# EAGLE design 4_Button_Array_LED (EAGLE 9.5.2)
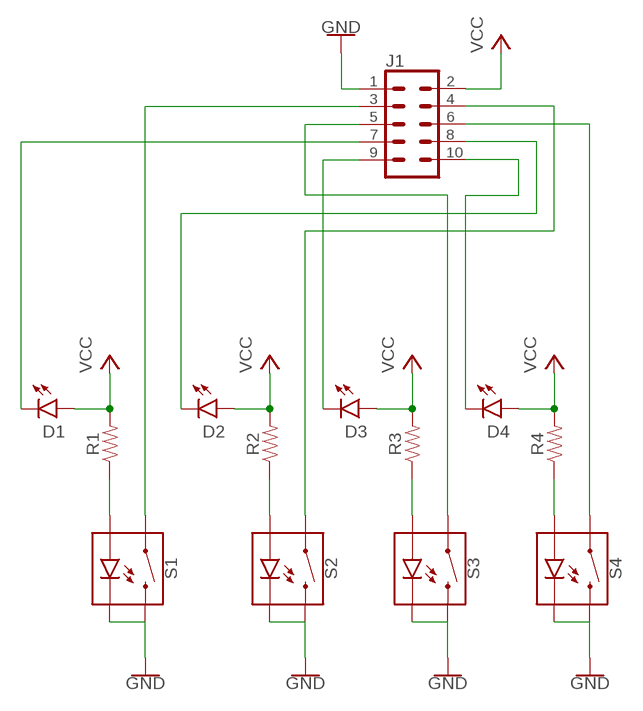
[diagram p0: schematic, sheet 1]

## Parts
D1  LED3MM  [LED_3MM]
D2  LED3MM  [LED_3MM]
D3  LED3MM  [LED_3MM]
D4  LED3MM  [LED_3MM]
J1  CONN_05X2SHD-NS  [2X5-SHROUDED-NS]
R1  RESISTOR1206  [1206]
R2  RESISTOR1206  [1206]
R3  RESISTOR1206  [1206]
R4  RESISTOR1206  [1206]
S1  MOMENTARY-SWITCH-SPST-LED-PTH-12MM  [TACTILE_SWITCH_LED_PTH_12MM]
S2  MOMENTARY-SWITCH-SPST-LED-PTH-12MM  [TACTILE_SWITCH_LED_PTH_12MM]
S3  MOMENTARY-SWITCH-SPST-LED-PTH-12MM  [TACTILE_SWITCH_LED_PTH_12MM]
S4  MOMENTARY-SWITCH-SPST-LED-PTH-12MM  [TACTILE_SWITCH_LED_PTH_12MM]

## Nets
GND: J1.1 S1.2 S1.C S2.2 S2.C S3.2 S3.C S4.2 S4.C
N$1: R2.1 S2.A
N$2: R1.1 S1.A
N$3: R3.1 S3.A
N$4: R4.1 S4.A
N$5: J1.3 S1.4
N$6: J1.4 S2.4
N$7: J1.5 S3.4
N$8: J1.6 S4.4
N$9: D1.K(C) J1.7
N$10: D2.K(C) J1.8
N$11: D3.K(C) J1.9
N$12: D4.K(C) J1.10
VCC: D1.A D2.A D3.A D4.A J1.2 R1.2 R2.2 R3.2 R4.2

## Library data of the parts
D1-D4 = SparkFun-LED:LED: LED (Generic) Standard schematic elements and footprints for 5mm, 3mm, 1206, and 0603 sized LEDs. Generic LEDs with no color specified.; PROD_ID: DIO-08794
J1 = SparkFun-Connectors:CONN_05X2: Multi connection point. Often used as Generic Header-pin footprint for 0.1 inch spaced/style header connections For AVR SPI programming port, see special device with nice symbol: "AVR_SPI_PROG_5x2.dev" You can populate with any combo of single row headers, but if you'd like an exact match, check these: 2x5 AVR ICSP Male Header <https://www.sparkfun.com/products/778> (PRT-00778) 2x5 Pin Shrouded Header <https://www.sparkfun.com/products/8506> (PRT-08506) On any of the 0.1 inch spaced packages, you can populate with these: Break Away Headers - Straight <https://www.sparkfun.com/products/116> (PRT-00116) Break Away Male Headers - Right Angle <https://www.sparkfun.com/products/553> (PRT-00553) Female Headers <https://www.sparkfun.com/products/115> (PRT-00115) Break Away Headers - Machine Pin <https://www.sparkfun.com/products/117> (PRT-00117) Break Away Female Headers - Swiss Machine Pin <https://www.sparkfun.com/products/743> (PRT-00743) Special note: the shrouded connector mates well with our 5x2 ribbon cables: 2x5 Pin IDC Ribbon Cable <https://www.sparkfun.com/products/8535> (PRT-08535); PROD_ID: CONN-08671; SF_ID: PRT-08506
R1-R4 = SparkFun-Resistors:RESISTOR: Generic Resistor Package
S1-S4 = SparkFun-Switches:MOMENTARY-SWITCH-SPST-LED: Momentary Switch (Pushbutton) - SPST - w/ LED Normally-open (NO) SPST momentary switches (buttons, pushbuttons), with a built-in LED. Variants PTH-CHERRY - Cherry MX Switch Cherry MX Keyswitches are top-of-the-line mechanical keyboard switches. They’re satisfyingly “clicky”, reliable up to tens-of-millions of key presses, and a standard in gaming and programming keyboards across the globe. This ‘blue’ version Cherry MX Switch is favored by most due to its secondary internal actuator making it less likely to “double-tap.” If you are looking for a noticeably audible and high-quality key switch, this is the perfect option for you! Cherry MX Switch <https://www.sparkfun.com/products/13834> (COM-13834) Cherry MX Switch Breakout <https://www.sparkfun.com/products/13773> (BOB-13773) PTH-12MM and PTH-12MM-KIT - 12mm Illuminated LED KIT variant is for soldering kits. There is no tStop (covering up the top side of the pads with mask). This helps the beginner see which side they should be soldering too. LED Tactile Button Breakout <https://www.sparkfun.com/products/10467> (BOB-10467) LED Tactile Button - Red <https://www.sparkfun.com/products/10442> (COM-10442) LED Tactile Button - Blue <https://www.sparkfun.com/products/10443> (COM-10443) LED Tactile Button - Green <https://www.sparkfun.com/products/10440> (COM-10440) LED Tactile Button - Orange <https://www.sparkfun.com/products/10441> (COM-10441) LED Tactile Button - White <https://www.sparkfun.com/products/10439> (COM-10439); PROD_ID: SWCH-11758; SF_SKU: COM-10442

## Board
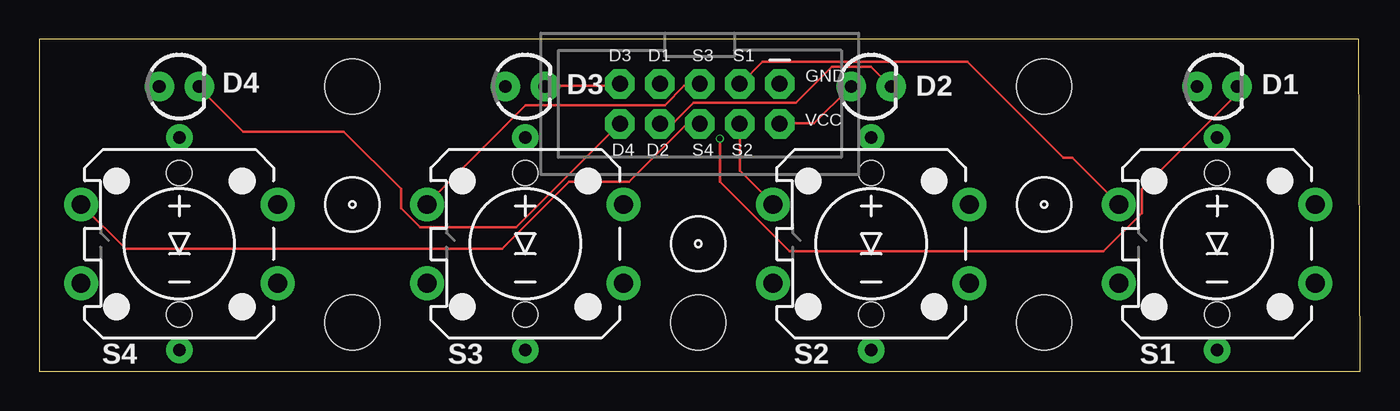
[diagram p1: board, top side]
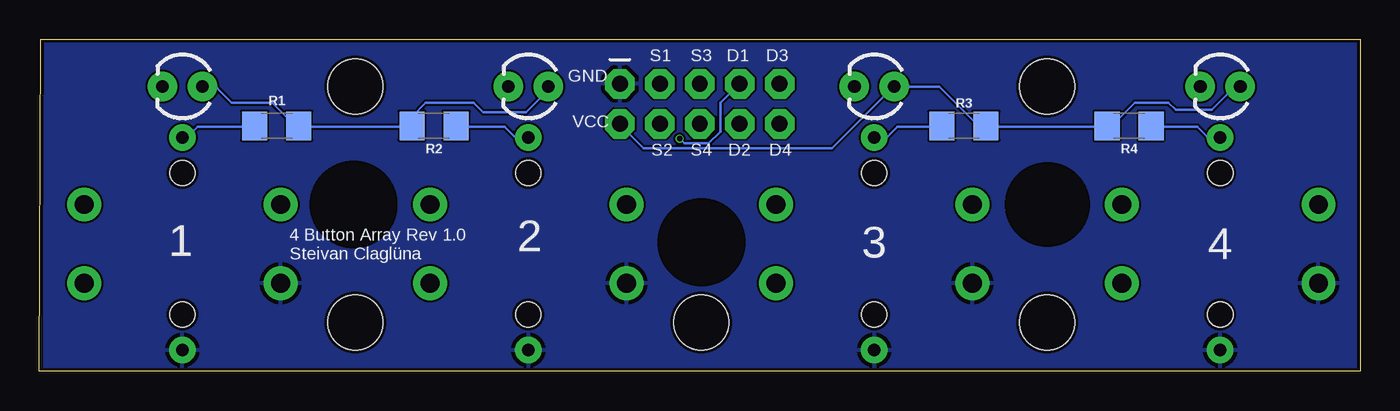
[diagram p2: board, bottom side, seen from below]

Size 84 x 21.1 mm. Coordinates in mm from the lower left corner, seen from the top.
Outline: 0,0 84,0 83.9,21.1 0,21.1 0,0
Copper layers (1*16): Top 0.035mm / dielectric 1.6mm / Bottom 0.035mm
Design rules "jlcpcb-2layers": minimum track width 5mil, minimum drill 0.3mm, track to track 5mil, track to pad 5mil, pad to pad 5mil, via to via 5mil, smd to smd 5mil, copper to edge 0.2mm, drill to drill 6mil, minimum pad ring 10mil, minimum via ring 3mil, stop-mask expansion 4mil, vias tented up to drill 0mil, thermal gap 10mil
Holes 3.5 mm at 19.9,18.1 63.9,18.1 19.9,3.1 41.9,3.1 63.9,3.1
tRestrict: area 17.3,8 to 22.5,13.2; area 61.3,7.9 to 66.7,13.3; area 39.2,5.4 to 44.6,10.8
bRestrict: area 17.3,8 to 22.5,13.2; area 39.2,5.5 to 44.6,10.9; area 61.3,7.9 to 66.7,13.3

### Footprints (pad centres in the part's own frame; a part is rotated, then mirrored left to right if it is on the bottom)
LED_3MM = drill 0.813 pad 1.88: A -1.27,0; K 1.27,0
2X5-SHROUDED-NS = drill 1.016 pad 1.88 octagon: 1 -1.27,5.08; 2 1.27,5.08; 3 -1.27,2.54; 4 1.27,2.54; 5 -1.27,0; 6 1.27,0; 7 -1.27,-2.54; 8 1.27,-2.54; 9 -1.27,-5.08; 10 1.27,-5.08
1206 = smd 1.6 x 1.8: 1 -1.4,0; 2 1.4,0
TACTILE_SWITCH_LED_PTH_12MM = drill 1.2 pad 2.159: 1 -6.25,2.5; 2 6.25,2.5; 3 -6.25,-2.5; 4 6.25,-2.5 | drill 0.8 pad 1.676: A 0,-6.75; C 0,6.75 | hole 1.6: 0,4.5; 0,-4.5

### Placement (x,y rotation side)
D1  74.9,18.1 0 top
D2  52.9,18.1 0 top
D3  30.9,18.1 0 top
D4  8.9,18.1 0 top
J1  42,17 270 top
R1  68.9,15.6 0 bottom
R2  58.9,15.6 180 bottom
R3  25.2,15.6 0 bottom
R4  14.7,15.6 180 bottom
S1  74.9,8.1 180 top
S2  52.9,8.1 180 top
S3  30.9,8.1 180 top
S4  8.9,8.1 180 top

### Tracks (layer width: path | path; a pad name or v marks a point on that pad's centre or on a via)
GND
  pour Bottom: -0.1,21 -0.1,0.1 0.2,-0.2 83.4,-0.2 83.7,0.1 83.7,21
N$1
  Bottom 0.152: R2.1 57.45,15.54 54.41,15.54 53.8,14.94 53.03,14.94 S2.A
N$2
  Bottom 0.152: R1.1 70.41,15.54 73.91,15.54 74.52,14.94 74.83,14.94 S1.A
N$3
  Bottom 0.152: R3.1 26.67,15.54 29.41,15.54 30.02,14.94 30.79,14.94 S3.A
N$4
  Bottom 0.152: R4.1 13.26,15.54 10.36,15.54 9.75,14.94 8.99,14.94 S4.A
N$5
  Top 0.152: J1.3 44.61,18.28 45.99,19.66 59.02,19.66 65.11,13.56 65.68,13.56 68.58,10.67 S1.4
N$6
  Top 0.152: J1.4 44.55,15.73 44.55,12.75 46.63,10.67 S2.4
N$7
  Top 0.152: J1.5 41.91,18.14 41,18.14 39.78,16.92 30.94,16.92 24.69,10.67 S3.4
N$8
  Top 0.152: J1.6 41.91,15.7 41.15,15.7 37.49,12.04 33.68,12.04 29.41,7.77 5.49,7.77 2.74,10.52 S4.4
N$9  (via drill 0.35)
  Top 0.152: v43.28,14.78 43.28,12.04 47.7,7.62 67.67,7.62 70.1,10.06 70.1,11.58 76.05,17.53 76.05,17.98 D1.K
  Bottom 0.152: v43.28,14.78 42.98,14.48 41.45,14.48 40.69,15.24 40.69,17.07 39.47,18.29 J1.7
N$10
  Top 0.152: J1.8 39.47,15.85 40.39,15.85 41.6,17.07 48.12,17.07 50.41,19.36 52.88,19.36 54.1,18.14 D2.K
N$11
  Top 0.152: D3.K 32.31,18.14 36.88,18.14 J1.9
N$12
  Top 0.152: J1.10 36.88,15.7 30.33,9.14 24.23,9.14 23.01,10.37 23.01,11.59 19.36,15.24 12.95,15.24 10.21,17.98 D4.K
VCC
  Top 0.152: J1.2 47.08,15.75 49.28,15.75 51.51,17.98 D2.A
  Bottom 0.152: D4.A 7.77,17.98 8.08,17.98 9.45,16.61 11.73,16.61 12.19,17.07 14.33,17.07 15.7,15.7 16,15.7 R4.2 16.15,15.54 23.77,15.54 R3.2 23.93,15.7 24.38,15.7 26.77,18.08 29.45,18.08 29.46,18.1 D3.A 29.64,18.08 29.68,18.08 33.59,14.17 45.57,14.17 47.09,15.7 J1.2 | D1.A 73.61,17.98 72.69,17.98 71.78,17.07 69.19,17.07 67.82,15.7 67.51,15.7 R1.2 67.36,15.54 60.35,15.54 R2.2 60.3,16.19 59.42,17.07 56.39,17.07 55.78,16.46 53.03,16.46 52.12,17.37 52.12,17.53 51.66,17.98 D2.A

### Text on the board
tNames: D3 | D1 | S3 | S1 | GND | VCC | D4 | D2 | S4 | S2
bNames: D3 | D1 | S3 | S1 | GND | VCC | D4 | D2 | S4 | S2 | 2 | 4 Button Array Rev 1.0 | 4 | 3 | Steivan Claglüna | 1